# Altium project Motherboard.PrjPcb
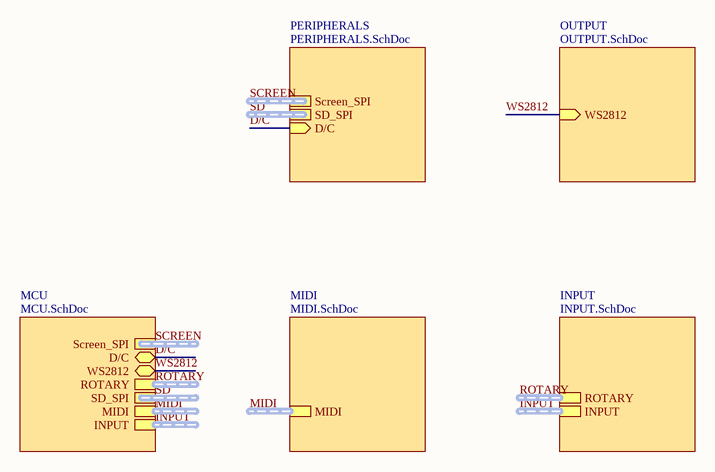
[diagram p0: Main.SchDoc]
6 sheets, 72 parts. Net scope: hierarchical (ports join the sheet entries above them; power ports are global).
Board file: Motherboard.PcbDoc
Sheets:
  Main.SchDoc
    MCU = MCU.SchDoc
    MIDI = MIDI.SchDoc
    INPUT = INPUT.SchDoc
    OUTPUT = OUTPUT.SchDoc
    PERIPHERALS = PERIPHERALS.SchDoc

## Sheet Main.SchDoc
size A4; SheetNumber: 1; SheetTotal: 6

### Sub-sheets
INPUT = INPUT.SchDoc: INPUT (harness INPUT), ROTARY (harness ROT)
MCU = MCU.SchDoc: Screen_SPI (harness SPI), D/C (bidir), WS2812 (bidir), ROTARY (harness ROT), SD_SPI (harness SPI), MIDI (harness MIDI), INPUT (harness INPUT)
MIDI = MIDI.SchDoc: MIDI (harness MIDI)
OUTPUT = OUTPUT.SchDoc: WS2812 (in)
PERIPHERALS = PERIPHERALS.SchDoc: Screen_SPI (harness SPI), SD_SPI (harness SPI), D/C (in)

### Nets
D/C: sheet MCU/D/C, sheet PERIPHERALS/D/C
WS2812: sheet MCU/WS2812, sheet OUTPUT/WS2812

### Buses and harness runs
harness INPUT = sheet INPUT/INPUT
harness INPUT = sheet MCU/INPUT
harness MIDI = sheet MCU/MIDI
harness MIDI = sheet MIDI/MIDI
harness ROTARY = sheet INPUT/ROTARY
harness ROTARY = sheet MCU/ROTARY
harness SCREEN = sheet MCU/Screen_SPI
harness SCREEN = sheet PERIPHERALS/Screen_SPI
harness SD = sheet MCU/SD_SPI
harness SD = sheet PERIPHERALS/SD_SPI

## Sheet MCU.SchDoc
size A4; SheetNumber: 2; SheetTotal: 6
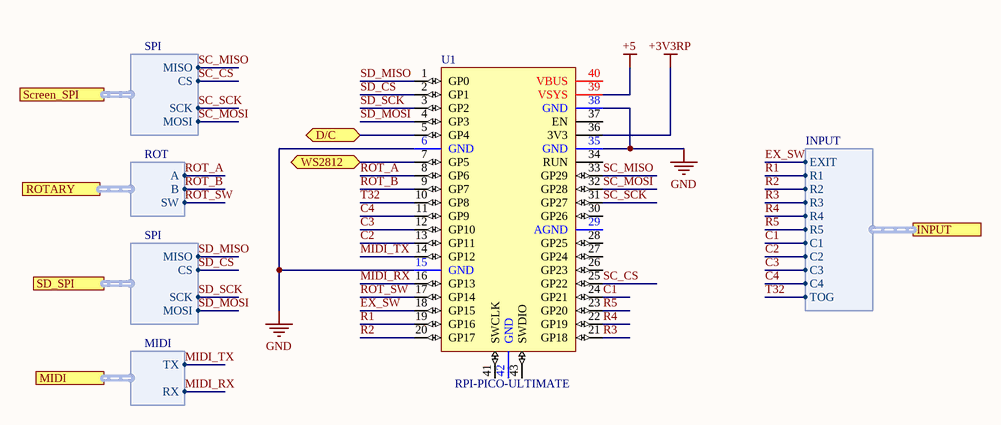
[diagram p1: MCU.SchDoc]

### Parts
U1  RPI-PICO-ULTIMATE  [SAMTEC SSW-110-03-T-S]

### Ports
D/C (bidir, see Main[2C], PERIPHERALS[2C]), INPUT (harness INPUT, see Main[2C], INPUT[1A]), MIDI (harness MIDI, see Main[2C], MIDI[2B]), ROTARY (harness ROT, see Main[2C], INPUT[1B]), Screen_SPI (harness SPI, see Main[2C], PERIPHERALS[1A]), SD_SPI (harness SPI, see Main[2C], PERIPHERALS[2A]), WS2812 (bidir, see Main[2C], OUTPUT[1A])

### Harnesses
SPI: MOSI, MISO, SCK, CS
ROT: A, B, SW
MIDI: TX, RX
INPUT: EXIT, R1, R2, R3, R4, R5, C1, C2, C3, C4, TOG

### Nets
+3V3RP: U1.36(3V3)
+5: U1.39(VSYS)
GND: U1.6(GND) U1.15(GND) U1.35(GND) U1.38(GND)
C1: U1.24(GP21) ; port INPUT.C1
C2: U1.13(GP11) ; port INPUT.C2
C3: U1.12(GP10) ; port INPUT.C3
C4: U1.11(GP9) ; port INPUT.C4
D/C: U1.5(GP4) ; port D/C
EX_SW: U1.18(GP15) ; port INPUT.EXIT
MIDI_RX: U1.16(GP13) ; port MIDI.RX  [project net MIDI.RX]
MIDI_TX: U1.14(GP12) ; port MIDI.TX  [project net MIDI.TX]
R1: U1.19(GP16) ; port INPUT.R1  [project net INPUT.R1]
R2: U1.20(GP17) ; port INPUT.R2  [project net INPUT.R2]
R3: U1.21(GP18) ; port INPUT.R3  [project net INPUT.R3]
R4: U1.22(GP19) ; port INPUT.R4  [project net INPUT.R4]
R5: U1.23(GP20) ; port INPUT.R5  [project net INPUT.R5]
ROT_A: U1.8(GP6) ; port ROTARY.A
ROT_B: U1.9(GP7) ; port ROTARY.B
ROT_SW: U1.17(GP14) ; port ROTARY.SW
SC_CS: U1.25(GP22) ; port Screen_SPI.CS
SC_MISO: U1.33(GP29) ; port Screen_SPI.MISO
SC_MOSI: U1.32(GP28) ; port Screen_SPI.MOSI
SC_SCK: U1.31(GP27) ; port Screen_SPI.SCK
SD_CS: U1.2(GP1) ; port SD_SPI.CS  [project net SD.CS]
SD_MISO: U1.1(GP0) ; port SD_SPI.MISO  [project net SD.MISO]
SD_MOSI: U1.4(GP3) ; port SD_SPI.MOSI  [project net SD.MOSI]
SD_SCK: U1.3(GP2) ; port SD_SPI.SCK  [project net SD.SCK]
T32: U1.10(GP8) ; port INPUT.TOG  [project net INPUT.TOG]
WS2812: U1.7(GP5) ; port WS2812

Not connected (* = marked no-connect by the designer): U1 26(GP23) 27(GP24) 28(GP25) 29(AGND) 30(GP26) 34(RUN) 37(EN) 40(VBUS) 41(SWCLK) 42(GND) 43(SWDIO)

### Library data of the parts
U1 = RPI-PICO-MOD_SM: RASPBERRY PI PICO RP2040 BOARD NO TEST PADS; Manufacturer: Raspberry Pi Foundation; Manufacturer Part No: SC0915; Mounting Technology: SMT; Supplier: DigiKey; Supplier Part No: 2648-SC0915CT-ND; Supplier Link: https://www.digikey.com/en/products/detail/raspberry-pi/SC0915/13684020

## Sheet MIDI.SchDoc
size A4; SheetNumber: 3; SheetTotal: 6
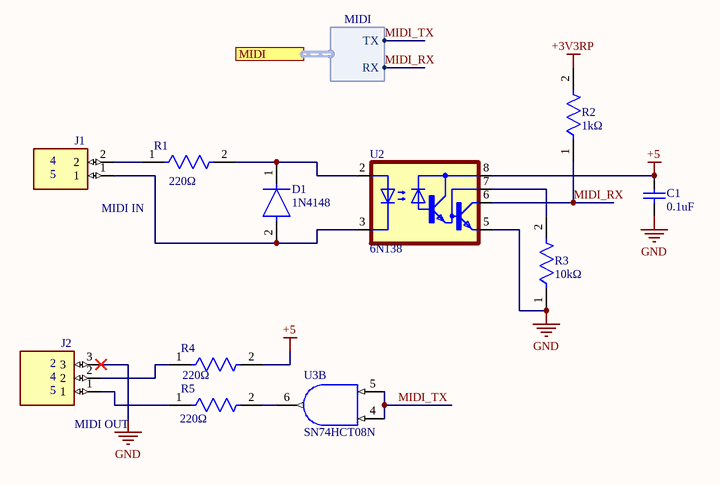
[diagram p2: MIDI.SchDoc]

### Parts
C1  0.1uF  [CAPR51-254-508X318X736]
D1  1N4148  [FP-017AG-MFG]
J1  MIDI IN  [SHDR2W100P0X500_1X2_1000X760X1]
J2  MIDI OUT  [39543-0603]
R1  Resistance: 220Ω  [FP-CMF50-0]  (hidden comment: CMF5073K200FHEB)
R2  Resistance: 1kΩ  [FP-CMF50-0]  (hidden comment: CMF5073K200FHEB)
R3  Resistance: 10kΩ  [FP-CMF50-0]  (hidden comment: CMF5073K200FHEB)
R4  Resistance: 220Ω  [FP-CMF50-0]  (hidden comment: CMF5073K200FHEB)
R5  Resistance: 220Ω  [FP-CMF50-0]  (hidden comment: CMF5073K200FHEB)
U2  6N138  [DIP762W50P254L1018H450Q8]
U3  SN74HCT08N  [N0014A]  (part B of 5)

### Ports
MIDI (harness MIDI, see Main[2C], MCU[1C])

### Harnesses
MIDI: TX, RX

### Nets
+3V3RP: R2.2
+5: C1.2 R4.2 U2.8(VCC)
GND: C1.1 J2.3 R3.1 U2.5(GND)
MIDI_RX: R2.1 U2.6(VO) ; port MIDI.RX  [project net MIDI.RX]
MIDI_TX: U3.4(2A) U3.5(2B) ; port MIDI.TX  [project net MIDI.TX]
NetD1_1: D1.1(C) R1.2 U2.2(A)
NetD1_2: D1.2(A) J1.1 U2.3(C)
NetJ1_2: J1.2 R1.1
NetJ2_1: J2.1 R5.1
NetJ2_2: J2.2 R4.1
NetR3_2: R3.2 U2.7(VB)
NetR5_2: R5.2 U3.6(2Y)

### Notes on the sheet
- (near J1) 4
- (near J1) 5
- (near J2) 4
- (near J2) 5
- (near J2) 2

### Library data of the parts
C1 = CMP-1664-00004-1: Radial Leaded Multilayer Ceramic Capacitor, 0.1 uF, +/- 10%, 50 V, -55 to 125 degC, 2-Pin THD, RoHS, Tape and Reel; Case\Package: SOT-23-5; Max Power Dissipation: 250 mW; Output Current: 150 mA; Dropout Voltage: 260 mV; Outputs: 1; Output Voltage: 5 V; Max Input Voltage: 8 V; Min Operating Temperature: -40 degC; Packaging: Tape and Reel; Height: 1.3 mm; Radiation Hardening: No; Pins: 5; ComponentLink1Description: Manufacturer URL; Mount: Surface Mount; RoHSCompliant: true; Max Operating Temperature: 85 degC; PackageReference: CAPR51-254-508X318X736; ComponentLink2URL: http://www.kemet.com/docfinder?Partnumber=C320C104K5R5TA; PackageDescription: 2-Pin Through Hole Device, Body 5.08 x 3.18 mm, Pitch 2.54 mm; ComponentLink1URL: http://www.kemet.com/; Width: 1.8 mm; Package Quantity: 3000; DatasheetVersion: Dec-15; Length: 3 mm; ComponentLink2Description: Datasheet
D1 = CMP-07163-000046-1: DIODE GEN PURP 100V 200MA DO35; Forward Voltage: 1V; Max Power Dissipation: 500mW; Max Reverse Current: 5uA; Forward Current: 300mA; Current: 4A; Reverse Recovery Time: 4ns; Element Configuration: Single; Outside Diameter: 1.85mm; Capacitance: 4pF; Polarity: Standard; Max Forward Surge Current (Ifsm): 1A; Reverse Voltage: 100V; Output Current: 200mA; Average Rectified Current: 200mA; Diameter: 1.91mm; Max Repetitive Reverse Voltage (Vrrm): 100V; Current Rating: 200mA; Case/Package: DO-35; Lead Free: Lead Free; Number of Pins: 2; Recovery Time: 4ns; Packaging: Bulk; Contact Plating: Tin; Voltage: 100V; Mount: Through Hole; Max Surge Current: 4A; Package Quantity: 2000; Width: 1.91mm; Max Reverse Voltage (DC): 100V; Length: 4.56mm; Radiation Hardening: No; Power Dissipation: 500mW; Voltage Rating (DC): 100V; Peak Non-Repetitive Surge Current: 4A; REACH SVHC: No SVHC; Height: 4.56mm; Max Operating Temperature: 175°C; Series: -; Weight: 0.01lb; Min Operating Temperature: -65°C
J1 = 39543-0602: 2 Position Wire to Board Terminal Block Horizontal with Board 0.197 (5.00mm) Through Hole; MF: Molex; MP: 395430602; Check_prices: https://www.snapeda.com/parts/395430602/Molex/view-part/?ref=eda; SnapEDA_Link: https://www.snapeda.com/parts/395430602/Molex/view-part/?ref=snap; Value: *; Package: None
J2 = 39543-0603: 3 Position Wire to Board Terminal Block Horizontal with Board 0.197 (5.00mm) Through Hole; MF: Molex; MP: 395430603; SnapEDA_Link: https://www.snapeda.com/parts/395430603/Molex/view-part/?ref=snap; Package: None; Value: *; Check_prices: https://www.snapeda.com/parts/395430603/Molex/view-part/?ref=eda
R1-R5 = CMP-00030-44386654-1: CMF5073K200FHEB Res Metal Film 73.2K Ohm 1% 0.125W(1/8W) ±50ppm/°C Epoxy AXL T/R; Voltage Rating: 200V; Power Rating: 125mW; Max Power Dissipation: 250mW; Number of Terminations: 2; Features: Flame Retardant Coating, Moisture Resistant; Termination: Axial; Diameter: 1.65mm; Packaging: Cut Tape; Min Operating Temperature: -55°C; Length: 3.81mm; Schedule B: 8533210090, 8533210090; Temperature Coefficient: 50ppm/°C; Tolerance: 1%; RoHS: Compliant; Voltage Rating (DC): 200V; Width: 1.65mm; Case/Package: Axial; Composition: Metal Film; Max Operating Temperature: 175°C; NexarPartId: 44386654; Lead Free: Lead Free; Mount: Through Hole
U2 = 6N138: ATT.NUM.P_TOT: 100 mW; Enclosure type (semiconductors): DIP 8; Forward current I(F): 20 mA; Forward voltage U(F): 1.1 V; Forward voltage U(F) typ.: 1.1 V; Insulation voltage: 5000 V RMS; Manufacturer: Lite-On; Manufacturer code (components): LTO; Mounting; MF: Isocom Components; SnapEDA_Link: https://www.snapeda.com/parts/6N138/Isocom/view-part/?ref=snap; Package: DIP-8 Lite-On; Value: *; MP: 6N138; Check_prices: https://www.snapeda.com/parts/6N138/Isocom/view-part/?ref=eda
U3 = CMP-0777-00257-3: Quadruple 2-Input Positive-AND Gates, N0014A, TUBE; Manufacturer: Texas Instruments; VCC(Max)(V): 5.5; Technology Family: HCT; tpd @ Nom Voltage(Max)(ns): 27; F @ Nom Voltage(Max)(Mhz): 25; ICC @ Nom Voltage(Max)(mA): 0.02; Rating: Catalog; Output Drive (IOL/IOH)(Max)(mA): -5.2/5.2; Output Type: CMOS; Input Type: TTL; Voltage(Nom)(V): 5; Schmitt Trigger: Yes; VCC(Min)(V): 4.5; Bits(#): 4; Generic Part Number: SN74HCT08; DatasheetVersion: SCLS063D; Operating Temperature Range(C): -40 to 85; PackageReference: N0014A

## Sheet INPUT.SchDoc
size A4; SheetNumber: 4; SheetTotal: 6
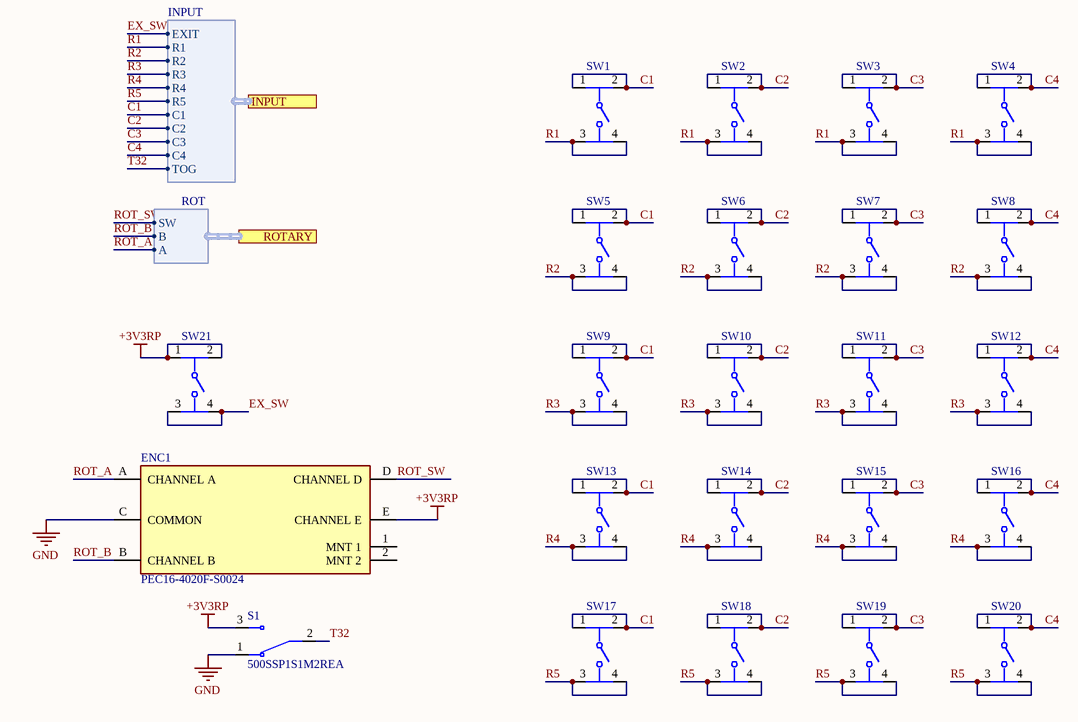
[diagram p3: INPUT.SchDoc]

### Parts
ENC1  PEC16-4020F-S0024  [FP-PEC16-4020F-S0024-MFG]
S1  500SSP1S1M2REA  [SW_500SSP1S1M2REA]
SW1  MJTP1212A  [FP-MJTP1212A-MFG]  (value not drawn)
SW2  MJTP1212A  [FP-MJTP1212A-MFG]  (value not drawn)
SW3  MJTP1212A  [FP-MJTP1212A-MFG]  (value not drawn)
SW4  MJTP1212A  [FP-MJTP1212A-MFG]  (value not drawn)
SW5  MJTP1212A  [FP-MJTP1212A-MFG]  (value not drawn)
SW6  MJTP1212A  [FP-MJTP1212A-MFG]  (value not drawn)
SW7  MJTP1212A  [FP-MJTP1212A-MFG]  (value not drawn)
SW8  MJTP1212A  [FP-MJTP1212A-MFG]  (value not drawn)
SW9  MJTP1212A  [FP-MJTP1212A-MFG]  (value not drawn)
SW10  MJTP1212A  [FP-MJTP1212A-MFG]  (value not drawn)
SW11  MJTP1212A  [FP-MJTP1212A-MFG]  (value not drawn)
SW12  MJTP1212A  [FP-MJTP1212A-MFG]  (value not drawn)
SW13  MJTP1212A  [FP-MJTP1212A-MFG]  (value not drawn)
SW14  MJTP1212A  [FP-MJTP1212A-MFG]  (value not drawn)
SW15  MJTP1212A  [FP-MJTP1212A-MFG]  (value not drawn)
SW16  MJTP1212A  [FP-MJTP1212A-MFG]  (value not drawn)
SW17  MJTP1212A  [FP-MJTP1212A-MFG]  (value not drawn)
SW18  MJTP1212A  [FP-MJTP1212A-MFG]  (value not drawn)
SW19  MJTP1212A  [FP-MJTP1212A-MFG]  (value not drawn)
SW20  MJTP1212A  [FP-MJTP1212A-MFG]  (value not drawn)
SW21  MJTP1212A  [FP-MJTP1212A-MFG]  (value not drawn)

### Ports
INPUT (harness INPUT, see Main[3C], MCU[3B]), ROTARY (harness ROT, see Main[3C], MCU[1B])

### Harnesses
INPUT: EXIT, R1, R2, R3, R4, R5, C1, C2, C3, C4, TOG
ROT: A, B, SW

### Nets
+3V3RP: ENC1.E(CHANNEL_E) S1.3(NO) SW21.1 SW21.2
GND: ENC1.C(COMMON) S1.1(NC)
C1: SW1.1 SW1.2 SW5.1 SW5.2 SW9.1 SW9.2 SW13.1 SW13.2 SW17.1 SW17.2 ; port INPUT.C1
C2: SW2.1 SW2.2 SW6.1 SW6.2 SW10.1 SW10.2 SW14.1 SW14.2 SW18.1 SW18.2 ; port INPUT.C2
C3: SW3.1 SW3.2 SW7.1 SW7.2 SW11.1 SW11.2 SW15.1 SW15.2 SW19.1 SW19.2 ; port INPUT.C3
C4: SW4.1 SW4.2 SW8.1 SW8.2 SW12.1 SW12.2 SW16.1 SW16.2 SW20.1 SW20.2 ; port INPUT.C4
EX_SW: SW21.3 SW21.4 ; port INPUT.EXIT
R1: SW1.3 SW1.4 SW2.3 SW2.4 SW3.3 SW3.4 SW4.3 SW4.4 ; port INPUT.R1  [project net INPUT.R1]
R2: SW5.3 SW5.4 SW6.3 SW6.4 SW7.3 SW7.4 SW8.3 SW8.4 ; port INPUT.R2  [project net INPUT.R2]
R3: SW9.3 SW9.4 SW10.3 SW10.4 SW11.3 SW11.4 SW12.3 SW12.4 ; port INPUT.R3  [project net INPUT.R3]
R4: SW13.3 SW13.4 SW14.3 SW14.4 SW15.3 SW15.4 SW16.3 SW16.4 ; port INPUT.R4  [project net INPUT.R4]
R5: SW17.3 SW17.4 SW18.3 SW18.4 SW19.3 SW19.4 SW20.3 SW20.4 ; port INPUT.R5  [project net INPUT.R5]
ROT_A: ENC1.A(CHANNEL_A) ; port ROTARY.A
ROT_B: ENC1.B(CHANNEL_B) ; port ROTARY.B
ROT_SW: ENC1.D(CHANNEL_D) ; port ROTARY.SW
T32: S1.2(COM) ; port INPUT.TOG  [project net INPUT.TOG]

Not connected (* = marked no-connect by the designer): ENC1 1(MNT_1) 2(MNT_2)

### Library data of the parts
ENC1 = CMP-07421-000008-1: ROTARY ENCODER MECHANICAL 24PPR; Number of Channels: 2; Pulses per Revolution: 24; Detent: No; Built in Switch: Yes; Output Type: Quadrature; Contact Plating: Tin; Termination: PC Pin; Encoder Type: Mechanical; Package Quantity: 50; Series: PEC16; Min Operating Temperature: -30°C; RoHS Compliant: Yes; Packaging: Bulk; Type: Mechanical; Length: 28mm; Orientation: Vertical; Mount: Through Hole; Max Operating Temperature: 70°C
S1 = 500SSP1S1M2REA: Slide Switch SPDT Through Hole  <a href="https://pricing.snapeda.com/parts/500SSP1S1M2REA/E-Switch/view-part?ref=eda">Check availability</a> <a href="https://pricing.snapeda.com/parts/500SSP1S1M2REA/E-Switch/view-part?ref=eda">Check availability</a>; Value: *; MP: 500SSP1S1M2REA; Availability: Unavailable; Package: None; Price: None
SW1-SW21 = CMP-47024-000003-1: SWITCH TACTILE SPST-NO 0.05A 12V; Contact Resistance: 100mR; Operating Force: 160gf; Mechanical Life: 100000Cycles; Actuator Length: 3.5mm; Throw Configuration: SPST; Illumination Type: Non-Illuminated; Actuator Material: Polyoxymethylene; Actuator Type: Standard; Switch Travel: 0.3mm; Current Rating: 50mA; Switch Function: Off-Mom; Mount: Through Hole; Contact Plating: Silver; Max Voltage Rating (DC): 12V; Package Quantity: 100; Max Operating Temperature: 70°C; Packaging: Bulk; Voltage Rating (DC): 12V; Termination: PC Pin; Contact Material: Bronze; Orientation: Straight; Min Operating Temperature: -20°C; REACH SVHC: No SVHC; Electrical Life: 100000Cycles

## Sheet OUTPUT.SchDoc
size A4; SheetNumber: 5; SheetTotal: 6
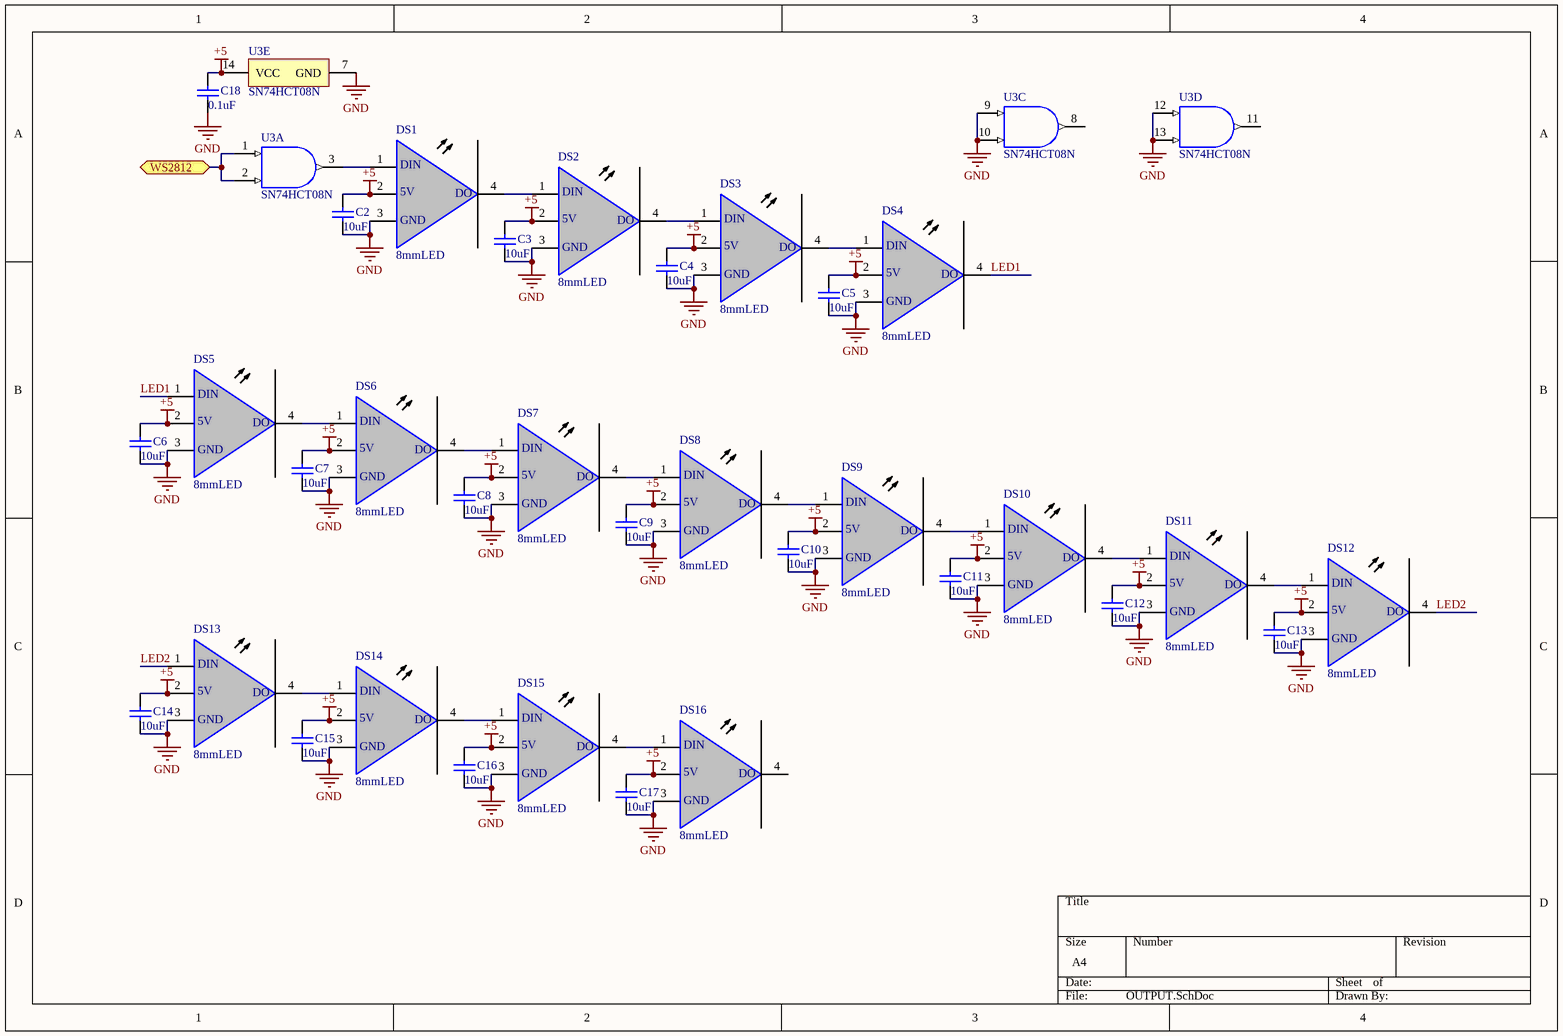
[diagram p4: OUTPUT.SchDoc]

### Parts
C2  10uF  [CAPR51-254-508X318X736]
C3  10uF  [CAPR51-254-508X318X736]
C4  10uF  [CAPR51-254-508X318X736]
C5  10uF  [CAPR51-254-508X318X736]
C6  10uF  [CAPR51-254-508X318X736]
C7  10uF  [CAPR51-254-508X318X736]
C8  10uF  [CAPR51-254-508X318X736]
C9  10uF  [CAPR51-254-508X318X736]
C10  10uF  [CAPR51-254-508X318X736]
C11  10uF  [CAPR51-254-508X318X736]
C12  10uF  [CAPR51-254-508X318X736]
C13  10uF  [CAPR51-254-508X318X736]
C14  10uF  [CAPR51-254-508X318X736]
C15  10uF  [CAPR51-254-508X318X736]
C16  10uF  [CAPR51-254-508X318X736]
C17  10uF  [CAPR51-254-508X318X736]
C18  0.1uF  [CAPR51-254-508X318X736]
DS1  8mmLED  [8mm]
DS2  8mmLED  [8mm]
DS3  8mmLED  [8mm]
DS4  8mmLED  [8mm]
DS5  8mmLED  [8mm]
DS6  8mmLED  [8mm]
DS7  8mmLED  [8mm]
DS8  8mmLED  [8mm]
DS9  8mmLED  [8mm]
DS10  8mmLED  [8mm]
DS11  8mmLED  [8mm]
DS12  8mmLED  [8mm]
DS13  8mmLED  [8mm]
DS14  8mmLED  [8mm]
DS15  8mmLED  [8mm]
DS16  8mmLED  [8mm]
U3  SN74HCT08N  [N0014A]  (parts A,C,D,E of 5)

### Ports
WS2812 (bidir, see Main[3B], MCU[2B])

### Nets
+5: C2.2 C3.2 C4.2 C5.2 C6.2 C7.2 C8.2 C9.2 C10.2 C11.2 C12.2 C13.2 C14.2 C15.2 C16.2 C17.2 C18.2 DS1.2(CATHODE) DS2.2(CATHODE) DS3.2(CATHODE) DS4.2(CATHODE) DS5.2(CATHODE) DS6.2(CATHODE) DS7.2(CATHODE) DS8.2(CATHODE) DS9.2(CATHODE) DS10.2(CATHODE) DS11.2(CATHODE) DS12.2(CATHODE) DS13.2(CATHODE) DS14.2(CATHODE) DS15.2(CATHODE) DS16.2(CATHODE) U3.14(VCC)
GND: C2.1 C3.1 C4.1 C5.1 C6.1 C7.1 C8.1 C9.1 C10.1 C11.1 C12.1 C13.1 C14.1 C15.1 C16.1 C17.1 C18.1 DS1.3(BLUE) DS2.3(BLUE) DS3.3(BLUE) DS4.3(BLUE) DS5.3(BLUE) DS6.3(BLUE) DS7.3(BLUE) DS8.3(BLUE) DS9.3(BLUE) DS10.3(BLUE) DS11.3(BLUE) DS12.3(BLUE) DS13.3(BLUE) DS14.3(BLUE) DS15.3(BLUE) DS16.3(BLUE) U3.7(GND) U3.9(3A) U3.10(3B) U3.12(4A) U3.13(4B)
LED1: DS4.4(GREEN) DS5.1(RED)
LED2: DS12.4(GREEN) DS13.1(RED)
WS2812: U3.1(1A) U3.2(1B) ; port WS2812
NetDS1_1: DS1.1(RED) U3.3(1Y)
NetDS1_4: DS1.4(GREEN) DS2.1(RED)
NetDS2_4: DS2.4(GREEN) DS3.1(RED)
NetDS3_4: DS3.4(GREEN) DS4.1(RED)
NetDS5_4: DS5.4(GREEN) DS6.1(RED)
NetDS6_4: DS6.4(GREEN) DS7.1(RED)
NetDS7_4: DS7.4(GREEN) DS8.1(RED)
NetDS8_4: DS8.4(GREEN) DS9.1(RED)
NetDS9_4: DS9.4(GREEN) DS10.1(RED)
NetDS10_4: DS10.4(GREEN) DS11.1(RED)
NetDS11_4: DS11.4(GREEN) DS12.1(RED)
NetDS13_4: DS13.4(GREEN) DS14.1(RED)
NetDS14_4: DS14.4(GREEN) DS15.1(RED)
NetDS15_4: DS15.4(GREEN) DS16.1(RED)

Not connected (* = marked no-connect by the designer): DS16 4(GREEN); U3 8(3Y) 11(4Y)

### Notes on the sheet
- (in symbol 8mmLED) DIN; 5V; DO; GND

### Library data of the parts
C2-C18 = CMP-1664-00004-1: as C1 on sheet MIDI; Min Operating Temperature: -40 degC; Packaging: Tape and Reel; Height: 1.3 mm; Radiation Hardening: No; Pins: 5; ComponentLink1Description: Manufacturer URL; Mount: Surface Mount; RoHSCompliant: true; Max Operating Temperature: 85 degC; PackageReference: CAPR51-254-508X318X736; ComponentLink2URL: http://www.kemet.com/docfinder?Partnumber=C320C104K5R5TA; PackageDescription: 2-Pin Through Hole Device, Body 5.08 x 3.18 mm, Pitch 2.54 mm; ComponentLink1URL: http://www.kemet.com/; Width: 1.8 mm; Package Quantity: 3000; DatasheetVersion: Dec-15; Length: 3 mm; ComponentLink2Description: Datasheet
DS1-DS16 = 8mmLED: WS2812
U3 = CMP-0777-00257-3: as U3 on sheet MIDI; Generic Part Number: SN74HCT08; DatasheetVersion: SCLS063D; Operating Temperature Range(C): -40 to 85; PackageReference: N0014A

## Sheet PERIPHERALS.SchDoc
size A4; SheetNumber: 6; SheetTotal: 6
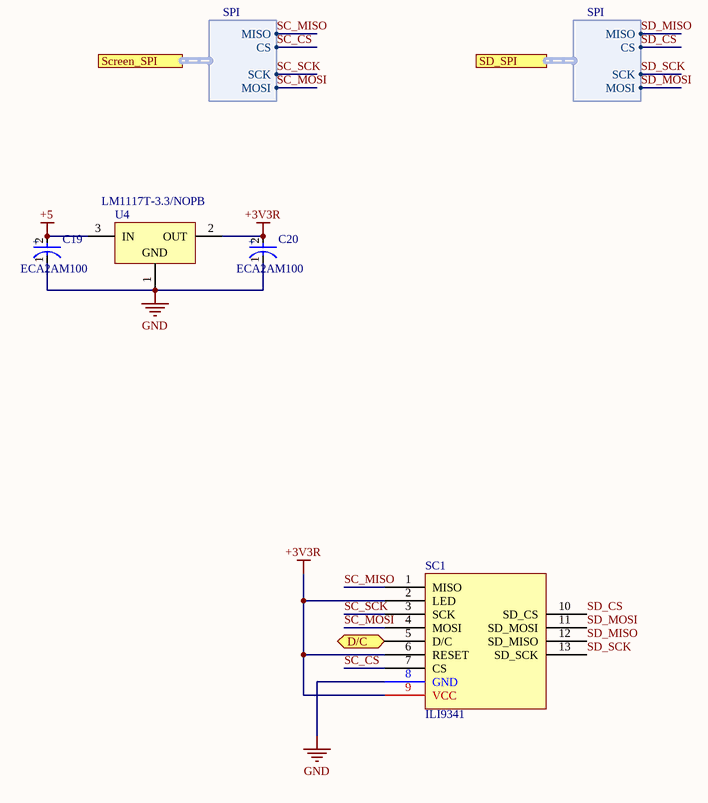
[diagram p5: PERIPHERALS.SchDoc]

### Parts
C19  ECA2AM100  [FP-RAD-TH-D_5_0_5-L_11_1-MFG]
C20  ECA2AM100  [FP-RAD-TH-D_5_0_5-L_11_1-MFG]
SC1  ILI9341  [ILI9341]
U4  LM1117T-3.3/NOPB  [NDE0003A]

### Ports
D/C (bidir, see Main[2B], MCU[2B]), Screen_SPI (harness SPI, see Main[2B], MCU[1B]), SD_SPI (harness SPI, see Main[2B], MCU[1B])

### Harnesses
SPI: MOSI, MISO, SCK, CS

### Nets
+3V3R: C20.2(A) SC1.2(LED) SC1.6(RESET) SC1.9(VCC) U4.2(OUT)
+5: C19.2(A) U4.3(IN)
GND: C19.1(C) C20.1(C) SC1.8(GND) U4.1(GND)
D/C: SC1.5(D/C) ; port D/C
SC_CS: SC1.7(CS) ; port Screen_SPI.CS
SC_MISO: SC1.1(MISO) ; port Screen_SPI.MISO
SC_MOSI: SC1.4(MOSI) ; port Screen_SPI.MOSI
SC_SCK: SC1.3(SCK) ; port Screen_SPI.SCK
SD_CS: SC1.10(SD_CS) ; port SD_SPI.CS  [project net SD.CS]
SD_MISO: SC1.12(SD_MISO) ; port SD_SPI.MISO  [project net SD.MISO]
SD_MOSI: SC1.11(SD_MOSI) ; port SD_SPI.MOSI  [project net SD.MOSI]
SD_SCK: SC1.13(SD_SCK) ; port SD_SPI.SCK  [project net SD.SCK]

### Notes on the sheet
- (in symbol CMP-05427-000869-1) +

### Library data of the parts
C19 C20 = CMP-05427-000869-1: Aluminum Electrolytic Capacitors (Radial Lead Type) 10uF ±20% 100V; Polarity: Polar; Lead Diameter: 0.5mm; Dissipation Factor: 0.1%; Leakage Current: 3uA; Dielectric Material: Aluminium; Ripple Current: 70mA; Life (Hours): 2000Hour; Lead/Base Style: Straight; Length: 11mm; Case/Package: Radial; Lead Pitch: 2mm; Contact Plating: Tin; RoHS Compliant: Yes; Radiation Hardening: No; Capacitance: 10uF; Max Operating Temperature: 85°C; Lead Free: Lead Free; Termination: Radial; Voltage Rating: 100V; Package Quantity: 200; Voltage: 100V; Construction: RADIAL; Height: 11mm; Min Operating Temperature: -40°C; Diameter: 5mm; REACH SVHC: No SVHC; Tolerance: 20%; Width: 5mm; Height - Seated (Max): 0.472inch; Mount: Through Hole; Series: M; Voltage Rating (DC): 100V; Packaging: Bulk; Ripple Current (AC): 70mA; Number of Pins: 2
U4 = CMP-0062-02494-3: 800mA Low-Dropout Linear Regulator, 3-pin TO-220, Pb-Free; Manufacturer: Texas Instruments; PackageTopMarking: NSUZXYTTE#*LM1117T*3.3; PowerWise: N; CompType: LDO IC; RoHS: Y; ComponentLink1URL: http://www.ti.com/general/docs/lit/getliterature.tsp?genericPartNumber=LM1117-N&fileType=pdf; PackageReference: NDE0003A; PinCount: 3; ComponentLink1Description: Datasheet URL; PackageDescription: TO-220, Molded, 3 Lead, Straight

## Nets that join several sheets
+3V3RP: MCU (U1.36), MIDI (R2.2), INPUT (ENC1.E S1.3 SW21.1 SW21.2)
+5: MCU (U1.39), MIDI (C1.2 R4.2 U2.8), OUTPUT (34 pins), PERIPHERALS (C19.2 U4.3)
GND: MCU (U1.6 U1.15 U1.35 U1.38), MIDI (C1.1 J2.3 R3.1 U2.5), INPUT (ENC1.C S1.1), OUTPUT (38 pins), PERIPHERALS (C19.1 C20.1 SC1.8 U4.1)
C1: MCU (U1.24), INPUT (10 pins)
C2: MCU (U1.13), INPUT (10 pins)
C3: MCU (U1.12), INPUT (10 pins)
C4: MCU (U1.11), INPUT (10 pins)
D/C: MCU (U1.5), PERIPHERALS (SC1.5)
EX_SW: MCU (U1.18), INPUT (SW21.3 SW21.4)
INPUT.R1: MCU (U1.19), INPUT (8 pins)
INPUT.R2: MCU (U1.20), INPUT (8 pins)
INPUT.R3: MCU (U1.21), INPUT (8 pins)
INPUT.R4: MCU (U1.22), INPUT (8 pins)
INPUT.R5: MCU (U1.23), INPUT (8 pins)
INPUT.TOG: MCU (U1.10), INPUT (S1.2)
MIDI.RX: MCU (U1.16), MIDI (R2.1 U2.6)
MIDI.TX: MCU (U1.14), MIDI (U3.4 U3.5)
ROT_A: MCU (U1.8), INPUT (ENC1.A)
ROT_B: MCU (U1.9), INPUT (ENC1.B)
ROT_SW: MCU (U1.17), INPUT (ENC1.D)
SC_CS: MCU (U1.25), PERIPHERALS (SC1.7)
SC_MISO: MCU (U1.33), PERIPHERALS (SC1.1)
SC_MOSI: MCU (U1.32), PERIPHERALS (SC1.4)
SC_SCK: MCU (U1.31), PERIPHERALS (SC1.3)
SD.CS: MCU (U1.2), PERIPHERALS (SC1.10)
SD.MISO: MCU (U1.1), PERIPHERALS (SC1.12)
SD.MOSI: MCU (U1.4), PERIPHERALS (SC1.11)
SD.SCK: MCU (U1.3), PERIPHERALS (SC1.13)
WS2812: MCU (U1.7), OUTPUT (U3.1 U3.2)